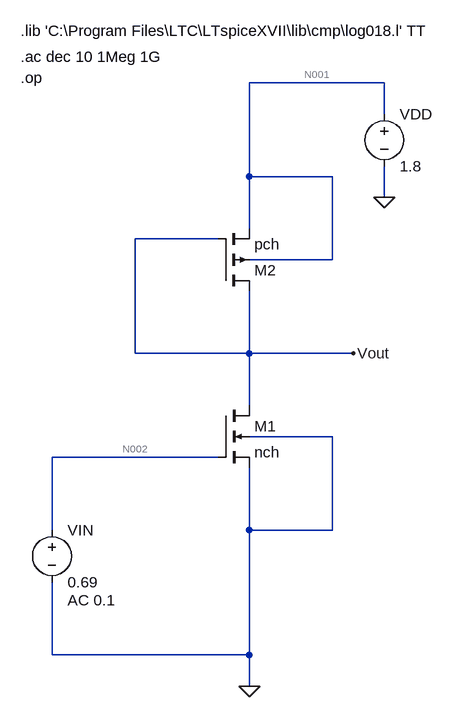
[diagram p0: schematic cir1-op.asc]
cir1-op.asc, the LTspice schematic file:
Version 4
SHEET 1 880 1060
WIRE 416 112 208 112
WIRE 416 160 416 112
WIRE 208 256 208 112
WIRE 336 256 208 256
WIRE 416 288 416 240
WIRE 208 336 208 256
WIRE 160 352 32 352
WIRE 336 384 336 256
WIRE 336 384 208 384
WIRE 32 528 32 352
WIRE 208 528 208 432
WIRE 208 528 32 528
WIRE 368 528 208 528
WIRE 208 608 208 528
WIRE 336 656 208 656
WIRE 160 688 -96 688
WIRE -96 800 -96 688
WIRE 208 800 208 704
WIRE 336 800 336 656
WIRE 336 800 208 800
WIRE -96 992 -96 880
WIRE 208 992 208 800
WIRE 208 992 -96 992
WIRE 208 1040 208 992
FLAG 416 288 0
FLAG 368 528 Vout
FLAG 208 1040 0
SYMBOL nmos4 160 608 R0
SYMATTR InstName M1
SYMATTR Value nch
SYMATTR Value2 l=1u w=3u
SYMBOL pmos4 160 432 M180
SYMATTR InstName M2
SYMATTR Value pch
SYMATTR Value2 l=1u w=15u
SYMBOL voltage 416 144 R0
WINDOW 123 0 0 Left 0
WINDOW 39 0 0 Left 0
SYMATTR InstName VDD
SYMATTR Value 1.8
SYMBOL voltage -96 784 R0
WINDOW 123 24 124 Left 2
WINDOW 39 0 0 Left 0
SYMATTR Value2 AC 0.1
SYMATTR InstName VIN
SYMATTR Value 0.69
TEXT -144 32 Left 2 !.lib 'C:\\Program Files\\LTC\\LTspiceXVII\\lib\\cmp\\log018.l' TT
TEXT -144 72 Left 2 !.ac dec 10 1Meg 1G
TEXT -144 104 Left 2 !.op

The netlist it stands for:
* cir1-op.asc
M1 Vout N002 0 0 nch l=1u w=3u
M2 Vout Vout N001 N001 pch l=1u w=15u
VDD N001 0 1.8
VIN N002 0 0.69 AC 0.1
.model NMOS NMOS
.model PMOS PMOS
.lib standard.mos
.lib 'C:\Program Files\LTC\LTspiceXVII\lib\cmp\log018.l' TT
.ac dec 10 1Meg 1G
.op
.backanno
.end

* Results of the author's LTspice run, read from the files saved beside the schematic
* Operating Point, zero values left out:
*   V(vout) = 1.1 V
*   V(n002) = 690 mV
*   V(n001) = 1.8 V
*   Id(M2) = -29.4 µA
*   Is(M2) = 29.4 µA
*   Id(M1) = 29.4 µA
*   Ib(M1) = -19.51 pA
*   Is(M1) = -29.4 µA
*   I(Vdd) = -29.4 µA
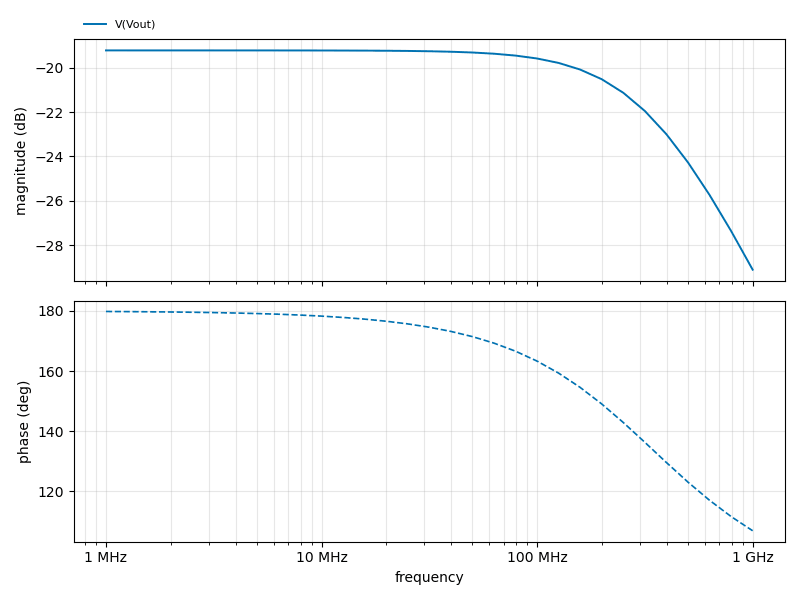
[diagram p1: AC Analysis of cir1-op.asc, plotted from the saved traces]
* AC Analysis, 1 run:
*   V(Vout): -19.21 dB at 1 MHz, -29.11 dB at 1 GHz, peak -19.21 dB at 1 MHz, 3 dB below the peak at 335.9 MHz
* From the log:
*   Semiconductor Device Operating Points:
*                           --- BSIM3 MOSFETS ---
*   Name:        m2          m1
*   Model:      pch.2       nch.5
*   Id:       -2.94e-05    2.94e-05
*   Vgs:      -7.00e-01    6.90e-01
*   Vds:      -7.00e-01    1.10e+00
*   Vbs:       0.00e+00    0.00e+00
*   Vth:      -4.57e-01    4.82e-01
*   Vdsat:    -2.28e-01    2.34e-01
*   Gm:        2.09e-04    2.32e-04
*   Gds:       1.28e-06    8.66e-07
*   Gmb        6.93e-05    6.67e-05
*   Cbd:       0.00e+00    0.00e+00
*   Cbs:       0.00e+00    0.00e+00
*   Cgsov:     4.91e-15    1.09e-15
*   Cgdov:     4.91e-15    1.09e-15
*   Cgbov:     2.73e-16    1.81e-16
*   dQgdVgb:   1.04e-13    1.97e-14
*   dQgdVdb:  -4.94e-15   -1.09e-15
*   dQgdVsb:  -9.39e-14   -1.67e-14
*   dQddVgb:  -5.10e-15   -1.10e-15
*   dQddVdb:   5.01e-15    1.10e-15
*   dQddVsb:   1.51e-16    1.17e-17
*   dQbdVgb:  -1.52e-14   -2.07e-15
*   dQbdVdb:  -2.15e-17    1.93e-19
*   dQbdVsb:  -1.48e-14   -4.16e-15